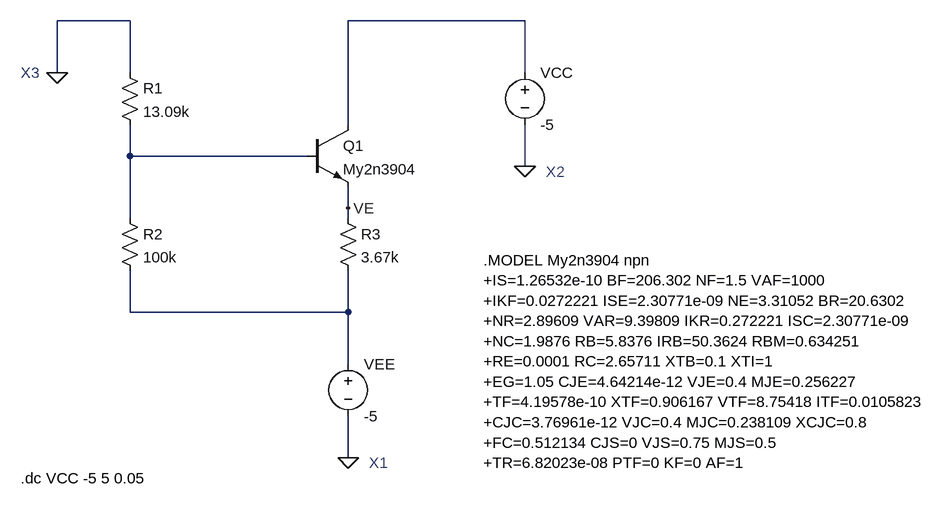
[diagram p0: schematic part3 schematic.asc]
part3 schematic.asc, the LTspice schematic file:
Version 4
SHEET 1 1464 704
WIRE 176 -16 64 -16
WIRE 784 -16 512 -16
WIRE 64 64 64 -16
WIRE 176 64 176 -16
WIRE 784 64 784 -16
WIRE 512 144 512 -16
WIRE 176 192 176 144
WIRE 448 192 176 192
WIRE 784 208 784 144
WIRE 512 272 512 240
WIRE 176 288 176 192
WIRE 512 288 512 272
WIRE 176 432 176 368
WIRE 512 432 512 368
WIRE 512 432 176 432
WIRE 512 512 512 432
WIRE 512 656 512 592
FLAG 64 64 0
FLAG 512 656 0
FLAG 784 208 0
FLAG 512 272 VE
SYMBOL res 160 48 R0
SYMATTR InstName R1
SYMATTR Value 13.09k
SYMBOL res 160 272 R0
SYMATTR InstName R2
SYMATTR Value 100k
SYMBOL res 496 272 R0
SYMATTR InstName R3
SYMATTR Value 3.67k
SYMBOL voltage 512 496 R0
WINDOW 123 0 0 Left 0
WINDOW 39 0 0 Left 0
SYMATTR InstName VEE
SYMATTR Value -5
SYMBOL voltage 784 48 R0
WINDOW 123 0 0 Left 0
WINDOW 39 0 0 Left 0
SYMATTR InstName VCC
SYMATTR Value -5
SYMBOL npn 448 144 R0
SYMATTR InstName Q1
SYMATTR Value My2n3904
TEXT 720 352 Left 2 !.MODEL My2n3904 npn\n+IS=1.26532e-10 BF=206.302 NF=1.5 VAF=1000\n+IKF=0.0272221 ISE=2.30771e-09 NE=3.31052 BR=20.6302\n+NR=2.89609 VAR=9.39809 IKR=0.272221 ISC=2.30771e-09\n+NC=1.9876 RB=5.8376 IRB=50.3624 RBM=0.634251\n+RE=0.0001 RC=2.65711 XTB=0.1 XTI=1\n+EG=1.05 CJE=4.64214e-12 VJE=0.4 MJE=0.256227\n+TF=4.19578e-10 XTF=0.906167 VTF=8.75418 ITF=0.0105823\n+CJC=3.76961e-12 VJC=0.4 MJC=0.238109 XCJC=0.8\n+FC=0.512134 CJS=0 VJS=0.75 MJS=0.5\n+TR=6.82023e-08 PTF=0 KF=0 AF=1
TEXT 816 216 Left 2 ;X2
TEXT 544 664 Left 2 ;X1
TEXT 8 64 Left 2 ;X3
TEXT 8 688 Left 2 !.dc VCC -5 5 0.05

The netlist it stands for:
* part3 schematic.asc
R1 0 N002 13.09k
R2 N002 N003 100k
R3 VE N003 3.67k
VEE N003 0 -5
VCC N001 0 -5
Q1 N001 N002 VE 0 My2n3904
.model NPN NPN
.model PNP PNP
.lib standard.bjt
.MODEL My2n3904 npn
+IS=1.26532e-10 BF=206.302 NF=1.5 VAF=1000
+IKF=0.0272221 ISE=2.30771e-09 NE=3.31052 BR=20.6302
+NR=2.89609 VAR=9.39809 IKR=0.272221 ISC=2.30771e-09
+NC=1.9876 RB=5.8376 IRB=50.3624 RBM=0.634251
+RE=0.0001 RC=2.65711 XTB=0.1 XTI=1
+EG=1.05 CJE=4.64214e-12 VJE=0.4 MJE=0.256227
+TF=4.19578e-10 XTF=0.906167 VTF=8.75418 ITF=0.0105823
+CJC=3.76961e-12 VJC=0.4 MJC=0.238109 XCJC=0.8
+FC=0.512134 CJS=0 VJS=0.75 MJS=0.5
+TR=6.82023e-08 PTF=0 KF=0 AF=1
* X2
* X1
* X3
.dc VCC -5 5 0.05
.backanno
.end